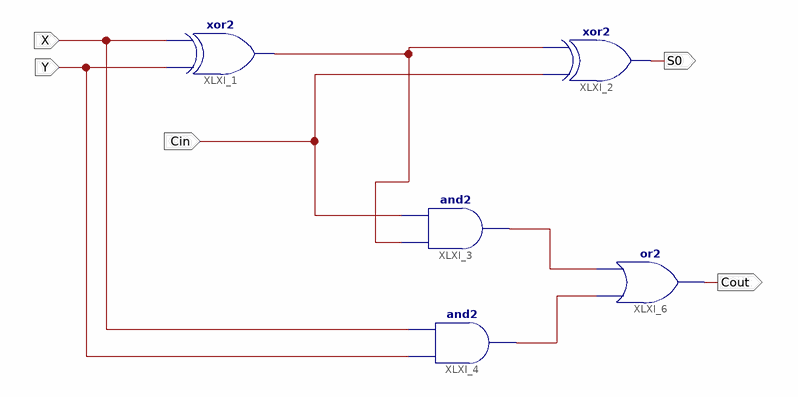
[diagram p0: schematic sheet 1]
// Xilinx ISE schematic Labo7.sch (xa9500xl) as structural Verilog: 5 symbols, 5 ports
module Labo7 (
  input  X,
  input  Y,
  input  Cin,
  output Cout,
  output S0
);

  wire XLXN_4, XLXN_6, XLXN_7;

  xor XLXI_1 (XLXN_4, Y, X);
  xor XLXI_2 (S0, Cin, XLXN_4);
  and XLXI_3 (XLXN_6, XLXN_4, Cin);
  and XLXI_4 (XLXN_7, Y, X);
  or XLXI_6 (Cout, XLXN_7, XLXN_6);
endmodule
